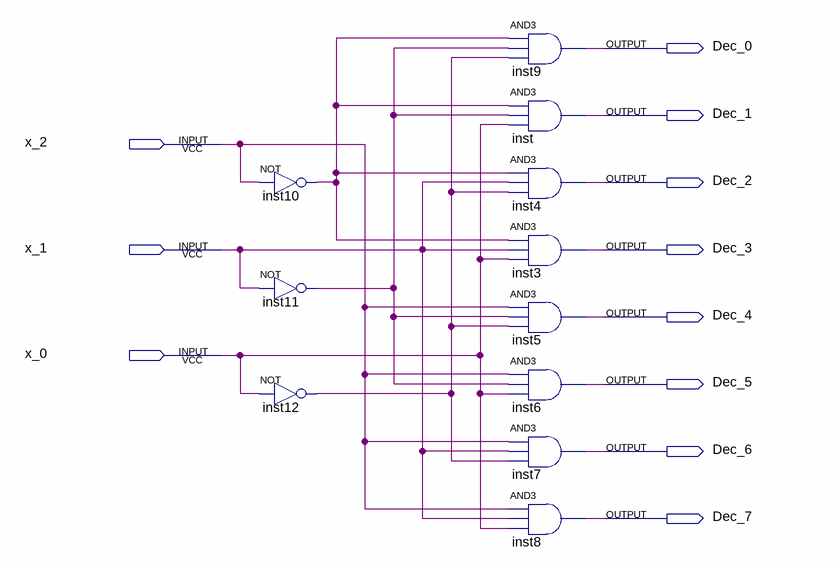
[diagram p0: schematic sheet]
// Quartus schematic 3_8_DEC.bdf as structural Verilog: 11 symbols, 11 pins
module \3_8_DEC  (
  input  x_2,
  input  x_1,
  input  x_0,
  output Dec_0,
  output Dec_1,
  output Dec_2,
  output Dec_3,
  output Dec_4,
  output Dec_5,
  output Dec_6,
  output Dec_7
);

  wire inst10_out, inst11_out, inst12_out;

  not inst10 (inst10_out, x_2);
  not inst11 (inst11_out, x_1);
  not inst12 (inst12_out, x_0);
  and inst9 (Dec_0, inst10_out, inst11_out, inst12_out);
  and inst (Dec_1, inst10_out, inst11_out, x_0);
  and inst4 (Dec_2, inst10_out, x_1, inst12_out);
  and inst3 (Dec_3, inst10_out, x_1, x_0);
  and inst5 (Dec_4, x_2, inst11_out, inst12_out);
  and inst6 (Dec_5, x_2, inst11_out, x_0);
  and inst7 (Dec_6, x_2, x_1, inst12_out);
  and inst8 (Dec_7, x_2, x_1, x_0);
endmodule
